# EAGLE design usb_lir2456_charger (EAGLE 6.5.0)
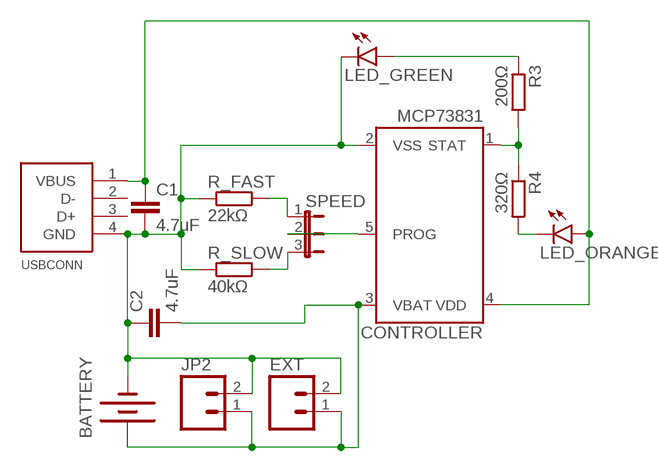
[diagram p0: schematic, sheet 1]

## Parts
BATTERY  BATTERY20PTH  [BATTCOM_20MM_PTH]
C1  4.7uF  C  [C0805]
C2  4.7uF  C  [C0805]
CONTROLLER  MCP73831  [SOT23-5]
EXT  M02PTH  [1X02]
JP2  M02JST-PTH-VERT  [JST-2-PTH-VERT]
LED_GREEN  LED0603  [LED-0603]
LED_ORANGE  LED0603  [LED-0603]
R3  200Ω  R  [R0805]
R4  320Ω  R  [R0805]
R_FAST  22kΩ  R  [R0805]
R_SLOW  40kΩ  R  [R0805]
SPEED  JP2E  [JP2]
USBCONN  USB-CON-4PIN  [USB-MALE-A-PCB]

## Nets
GND: BATTERY.2(-) C1.2 C2.1 CONTROLLER.2(VSS) EXT.2 JP2.2 LED_GREEN.C R_FAST.1 R_SLOW.1 USBCONN.4(GND)
N$1: CONTROLLER.1(STAT) R3.2 R4.1
N$3: CONTROLLER.5(PROG) SPEED.2
N$4: LED_GREEN.A R3.1
N$5: R_SLOW.2 SPEED.3
N$6: R_FAST.2 SPEED.1
N$7: LED_ORANGE.C R4.2
N$8: BATTERY.1(+) C2.2 CONTROLLER.3(VBAT) EXT.1 JP2.1
VCC: C1.1 CONTROLLER.4(VDD) LED_ORANGE.A USBCONN.1(VBUS)
Unconnected: USBCONN.2(D-) USBCONN.3(D+)

## Library data of the parts
BATTERY = SparkFun-Electromechanical:BATTERY: Battery Holders Various common sizes : AA, AAA, 18650 (PRT-12895), 20mm coin cell and 12mm coin cell. 20MM_4LEGS, BATT-10373
C1 C2 = eagle-ltspice:C: CAPACITOR, European symbol; SPICEMODEL: NONE; SPICEPREFIX: C
CONTROLLER = GeekAmmo:MCP73831: MCP73831 Miniature Single-Cell, Fully Integrated Li-Ion, Li-Polymer Charge Management Controllers The MCP73831/2 devices are highly advanced linear charge management controllers for use in spacelimited, cost-sensitive applications. http://ww1.microchip.com/downloads/en/DeviceDoc/20001984F.pdf
EXT JP2 = SparkFun-Connectors:M02: Standard 2-pin 0.1" header. Use with - straight break away headers ( PRT-00116) - right angle break away headers (PRT-00553) - swiss pins (PRT-00743) - machine pins (PRT-00117) - female headers (PRT-00115) Molex polarized connector foot print use with: PRT-08233 with associated crimp pins and housings. 2.54_SCREWTERM for use with PRT-10571. 3.5mm Screw Terminal footprints for PRT-08084 5mm Screw Terminal footprints for use with PRT-08432
LED_GREEN LED_ORANGE = SparkFun-LED:LED: LEDs Standard schematic elements and footprints for 5mm, 3mm, 1206, and 0603 sized LEDs. 5mm - Spark Fun Electronics SKU : COM-00529 (and others)
R3 R4 R_FAST R_SLOW = eagle-ltspice:R: RESISTOR, European symbol; SPICEMODEL: NONE; SPICEPREFIX: R
SPEED = jumper:JP2E: JUMPER
USBCONN = GeekAmmo:USB-CON-4PIN: USB Connector 4 Pin - No SHIELD

## Board
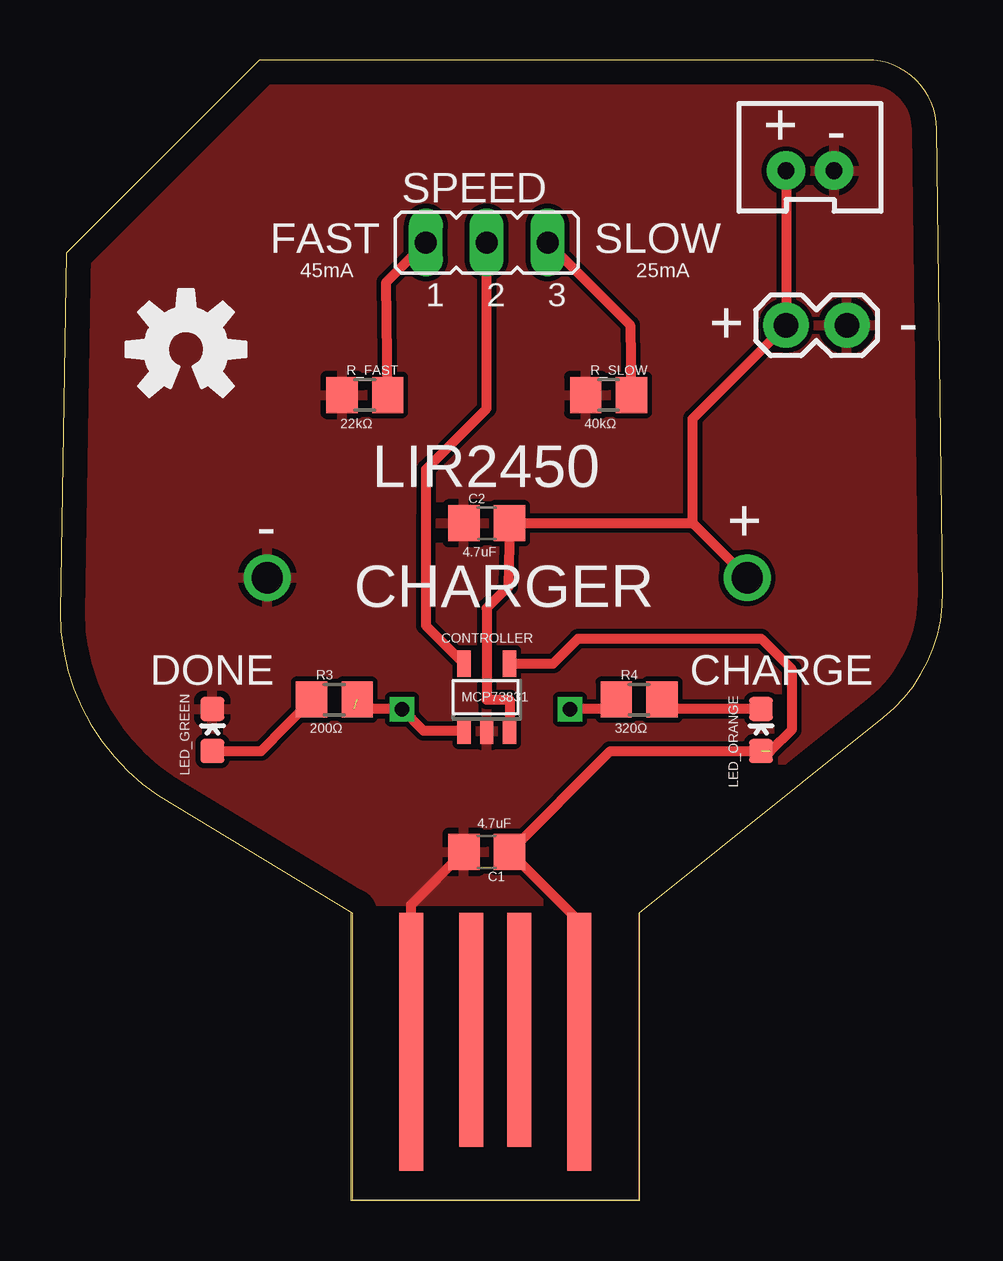
[diagram p1: board, top side]
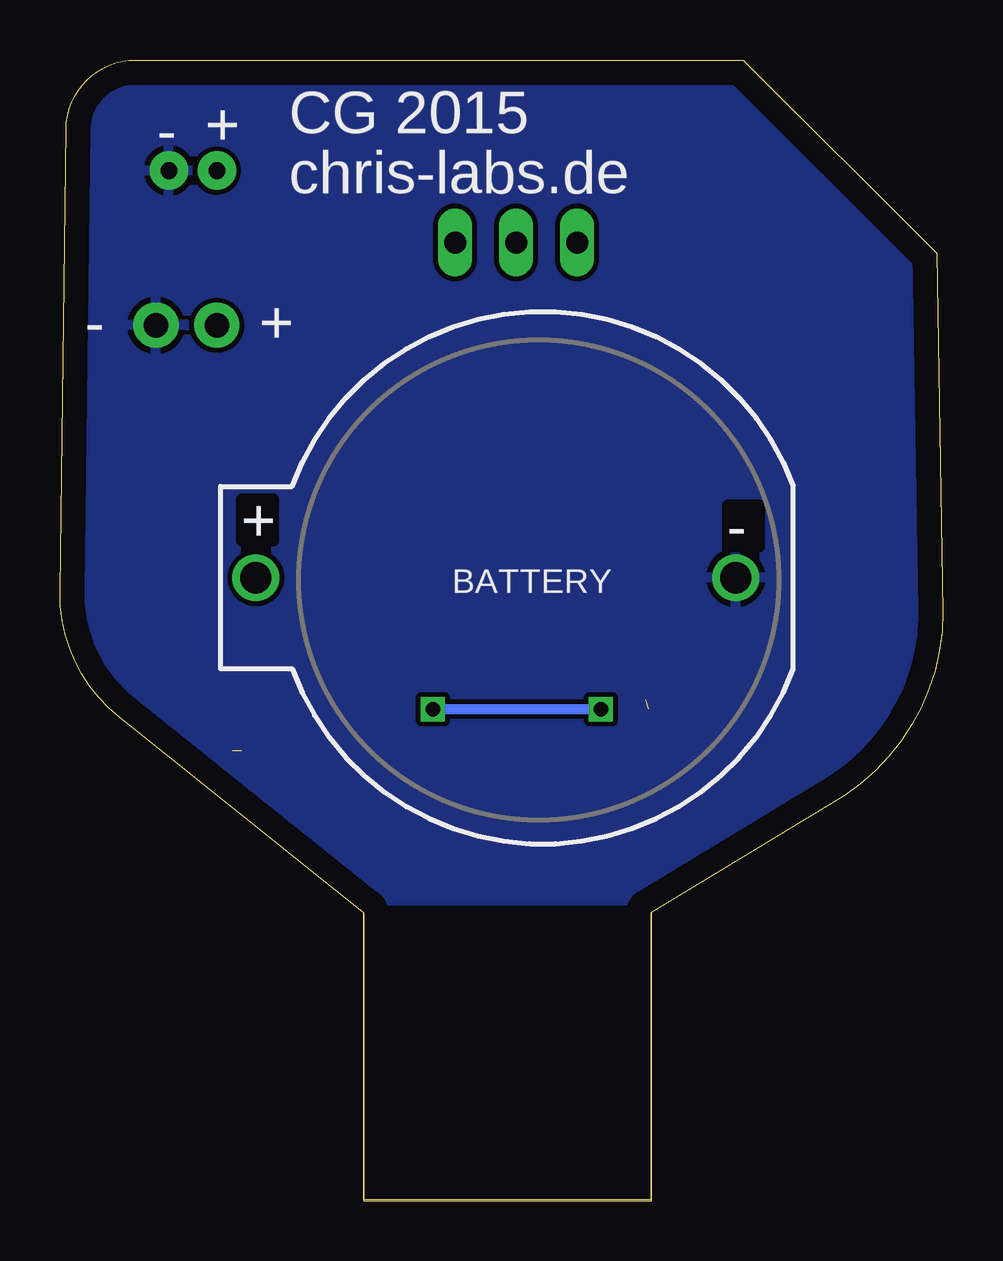
[diagram p2: board, bottom side, seen from below]

Size 36.79 x 47.55 mm. Coordinates in mm from the lower left corner, seen from the top.
Outline: 12.18,0.05 24.13,0.05 24.13,12 34.31,20.14 arc52 36.79,25.39 36.54,44.68 arc89 33.63,47.55 8.31,47.55 0.25,39.49 0,24.54 arc56 4.1,16.89 12.18,12 12.18,0.05
Copper layers (1*16): Top 0.035mm / dielectric 1.5mm / Bottom 0.035mm
Design rules "default": minimum track width 10mil, minimum drill 24mil, track to track 8mil, track to pad 8mil, pad to pad 8mil, via to via 8mil, smd to smd 8mil, copper to edge 40mil, drill to drill 8mil, minimum pad ring 10mil, minimum via ring 8mil, stop-mask expansion 4mil, vias tented up to drill 0mil, thermal gap 10mil

### Footprints (pad centres in the part's own frame; a part is rotated, then mirrored left to right if it is on the bottom)
BATTCOM_20MM_PTH = drill 1.3: 1 11.85,0; 2 -8.15,0
C0805 = smd 1.3 x 1.5: 1 -0.95,0; 2 0.95,0
SOT23-5 = smd 0.55 x 1.1: 1 -0.95,-1.3; 2 0,-1.3; 3 0.95,-1.3; 4 0.95,1.5; 5 -0.95,1.5
1X02 = drill 1.016 pad 1.88: 1 0,0; 2 2.54,0
JST-2-PTH-VERT = drill 0.7 pad 1.6: 1 -1,-0.55; 2 1,-0.55
LED-0603 = smd 1 x 1: A 0,-0.877; C 0,0.877
R0805 = smd 1.3 x 1.5: 1 -0.95,0; 2 0.95,0
JP2 = drill 0.914 long: 1 -2.54,0; 2 0,0; 3 2.54,0
USB-MALE-A-PCB = smd 1 x 10.76: 1 2.5,5.38; 4 9.5,5.38 | smd 1 x 9.76: 2 5,4.88; 3 7,4.88

### Placement (x,y rotation side)
BATTERY  16.78,25.97 180 bottom
C1  17.78,14.54 180 top
C2  17.78,28.24 0 top
CONTROLLER  17.78,20.89 0 top
EXT  30.25,36.49 0 top
JP2  31.25,43.49 0 top
LED_GREEN  6.35,19.62 0 top
LED_ORANGE  29.21,19.62 0 top
R3  11.43,20.89 0 top
R4  24.13,20.89 0 top
R_FAST  12.7,33.59 0 top
R_SLOW  22.86,33.59 0 top
SPEED  17.78,39.94 0 top
U$1  [OSHW-LOGO-M]  5.25,35.49 0 top
USBCONN  24.13,12 180 top

### Tracks (layer width: path | path; a pad name or v marks a point on that pad's centre or on a via)
GND
  Top 0.406: USBCONN.4 14.63,12.34 C1.2
  pour Top (isolate 0.012): 24.25,12.49 28.25,12.49 37.25,21.49 37.25,72.49 -1.75,41.49 -1.75,22.49 8.25,12.49
  pour Bottom: 11.25,11.49 11.25,12.49 28.25,12.49 40.25,24.49 40.25,48.49 5.25,48.49 4.25,49.49 -4.75,40.49 -4.75,19.49 3.25,11.49
N$1  (via drill 0.6)  (1 unrouted)
  Top 0.406: R4.1 22.78,20.49 v21.25,20.49 | 12.25,20.49 v14.25,20.49 15.15,19.59 CONTROLLER.1
  Bottom 0.406: v21.25,20.49 v14.25,20.49
N$3
  Top 0.406: CONTROLLER.5 15.24,23.98 15.24,28.51 15.25,28.52 15.25,30.49 17.78,33.02 SPEED.2
N$4
  Top 0.406: LED_GREEN.A 8.38,18.74 R3.1
N$5
  Top 0.406: SPEED.3 23.76,36.5 R_SLOW.2
N$6
  Top 0.406: R_FAST.2 13.6,38.3 SPEED.1
N$7
  Top 0.406: LED_ORANGE.C 25.42,20.5 R4.2
N$8
  Top 0.406: JP2.1 EXT.1 26.36,32.6 26.36,28.24 | CONTROLLER.3 18.73,20.89 17.78,20.89 17.78,24.7 18.68,25.6 C2.2 26.36,28.24 | 26.36,28.24 BATTERY.1
VCC  (1 unrouted)
  Top 0.406: CONTROLLER.4 20.55,22.39 21.59,23.43 29.21,23.43 30.48,22.16 30.48,19.62 29.6,18.74 | USBCONN.1 21.63,11.64 C1.1 22.93,18.74 LED_ORANGE.A

### Text on the board
Bottom: - | + | + | + | +
tNames: + | - | FAST | SLOW | 45mA | 25mA | + | - | LIR2450 | - | + | CHARGER | DONE | CHARGE
bNames: CG 2015 | + | - | chris-labs.de | + | - | - | +